# EAGLE design Adafruit AD849x_Thermo (EAGLE 8.7.1)
COMPANY: ADAFRUIT INDUSTRIES; DRAWN: KTOWN; REV: A
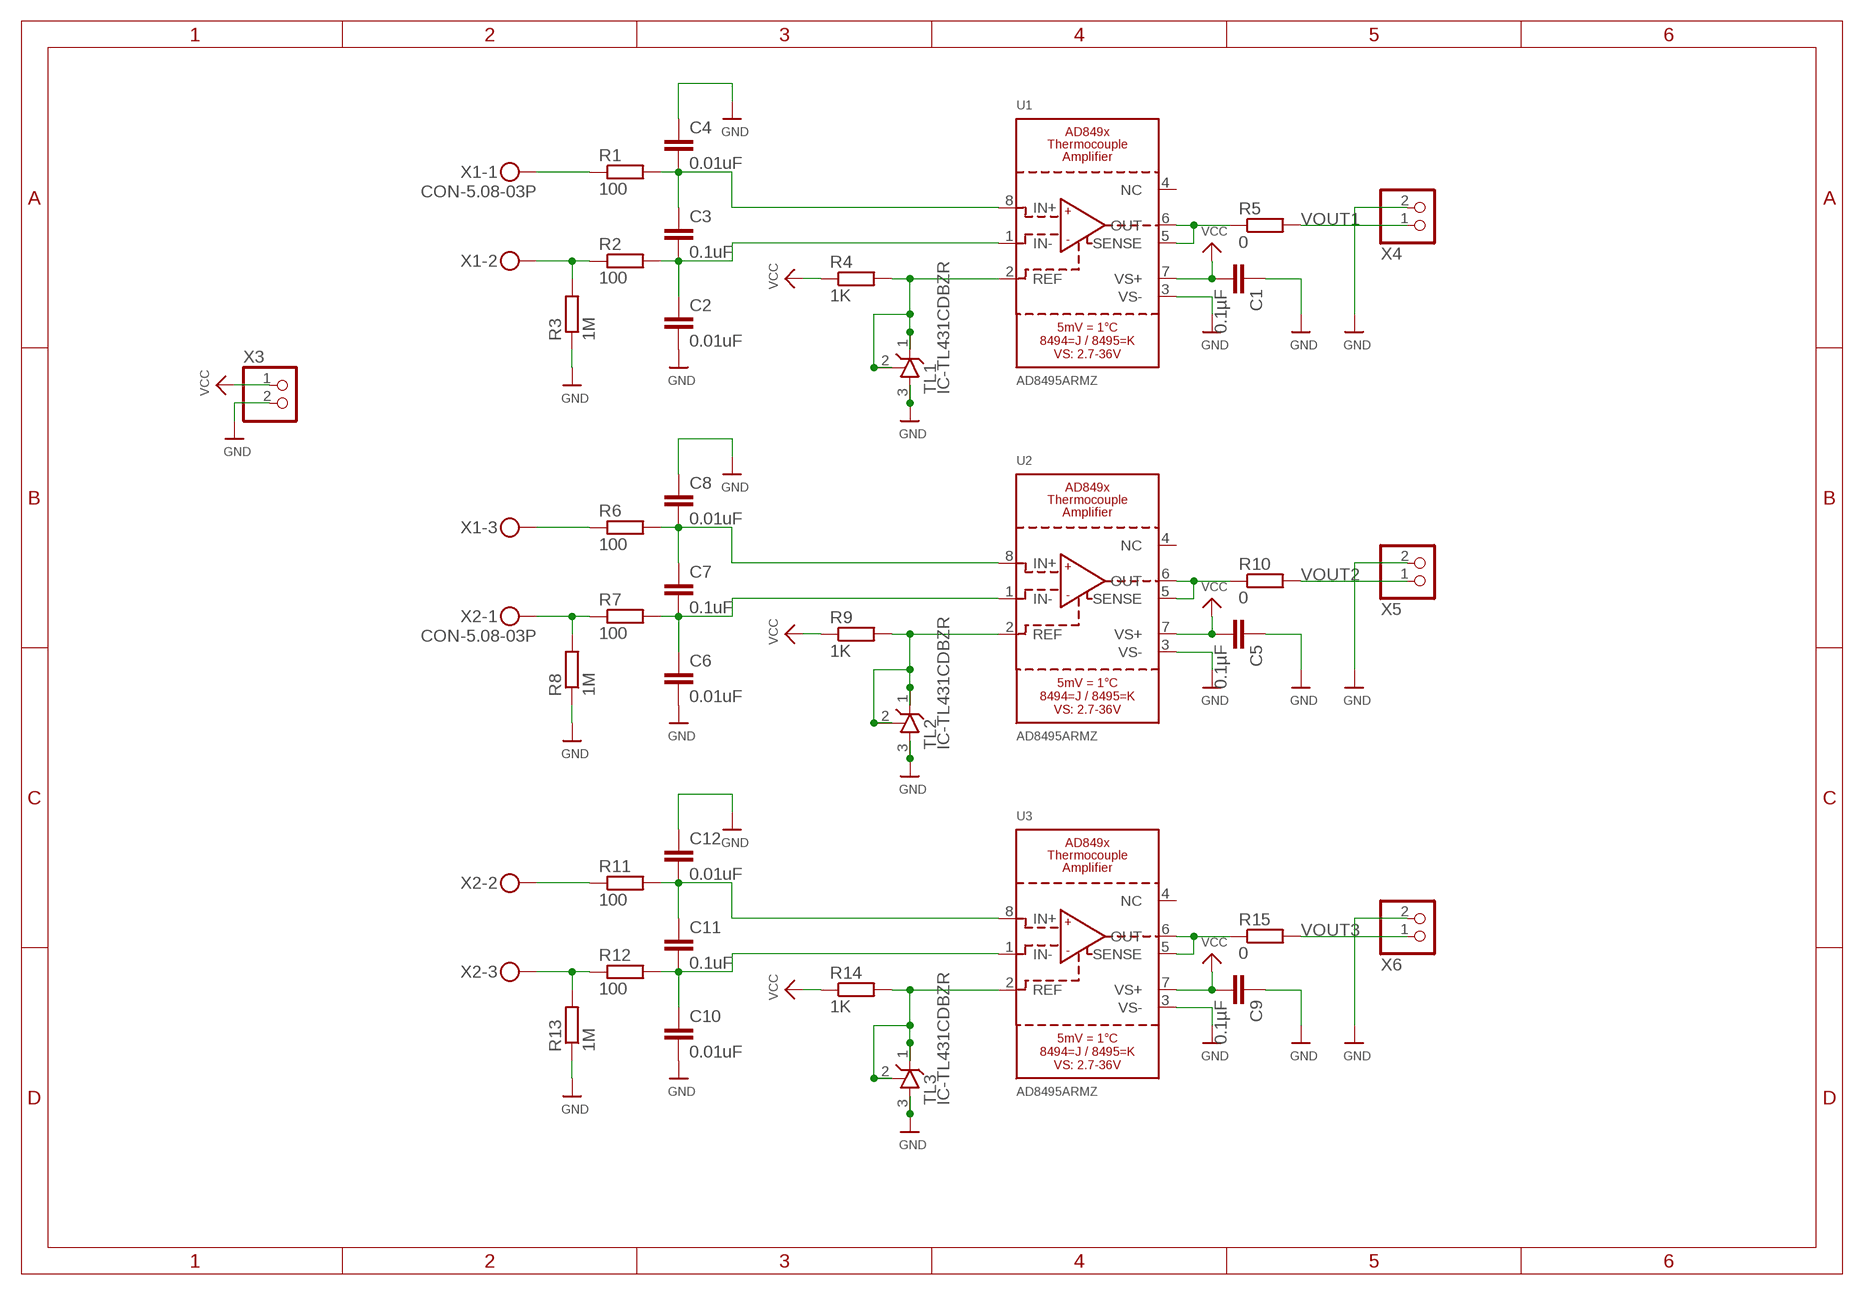
[diagram p0: schematic, sheet 1]

## Parts
C1  0.1µF  CAP_0805  [C0805]
C2  0.01uF  CAP_0805  [C0805]
C3  0.1uF  CAP_0805  [C0805]
C4  0.01uF  CAP_0805  [C0805]
C5  0.1µF  CAP_0805  [C0805]
C6  0.01uF  CAP_0805  [C0805]
C7  0.1uF  CAP_0805  [C0805]
C8  0.01uF  CAP_0805  [C0805]
C9  0.1µF  CAP_0805  [C0805]
C10  0.01uF  CAP_0805  [C0805]
C11  0.1uF  CAP_0805  [C0805]
C12  0.01uF  CAP_0805  [C0805]
R1  100  R_0805  [R0805]
R2  100  R_0805  [R0805]
R3  1M  R_0805  [R0805]
R4  1K  R_0805  [R0805]
R5  0  R_0805  [R0805]
R6  100  R_0805  [R0805]
R7  100  R_0805  [R0805]
R8  1M  R_0805  [R0805]
R9  1K  R_0805  [R0805]
R10  0  R_0805  [R0805]
R11  100  R_0805  [R0805]
R12  100  R_0805  [R0805]
R13  1M  R_0805  [R0805]
R14  1K  R_0805  [R0805]
R15  0  R_0805  [R0805]
TL1  IC-TL431CDBZR  [SOT23]
TL2  IC-TL431CDBZR  [SOT23]
TL3  IC-TL431CDBZR  [SOT23]
U1  AD8495ARMZ  AD849X  [MSOP8_0.65MM]
U2  AD8495ARMZ  AD849X  [MSOP8_0.65MM]
U3  AD8495ARMZ  AD849X  [MSOP8_0.65MM]
X1  CON-5.08-03P  [MKDSN1,5/3-5,08]
X2  CON-5.08-03P  [MKDSN1,5/3-5,08]
X3  CON-CP-02  [CON-CT-02]
X4  CON-CP-02  [CON-CT-02]
X5  CON-CP-02  [CON-CT-02]
X6  CON-CP-02  [CON-CT-02]

## Nets
GND: C1.1 C2.2 C4.1 C5.1 C6.2 C8.1 C9.1 C10.2 C12.1 R3.1 R8.1 R13.1 TL1.3(A) TL2.3(A) TL3.3(A) U1.3(VS-) U2.3(VS-) U3.3(VS-) X3.2 X4.2 X5.2 X6.2
IN+: R1.1 X1.1
IN+1: R6.1 X1.3
IN+2: R11.1 X2.2
IN-: R2.1 R3.2 X1.2
IN-1: R7.1 R8.2 X2.1
IN-2: R12.1 R13.2 X2.3
N$1: R4.2 TL1.1(C) TL1.2(R) U1.2(REF)
N$2: C3.1 C4.2 R1.2 U1.8(IN+)
N$3: C2.1 C3.2 R2.2 U1.1(IN-)
N$4: R5.2 X4.1
N$6: C7.1 C8.2 R6.2 U2.8(IN+)
N$7: C6.1 C7.2 R7.2 U2.1(IN-)
N$8: R9.2 TL2.1(C) TL2.2(R) U2.2(REF)
N$9: R10.2 X5.1
N$10: C11.1 C12.2 R11.2 U3.8(IN+)
N$11: C10.1 C11.2 R12.2 U3.1(IN-)
N$12: R14.2 TL3.1(C) TL3.2(R) U3.2(REF)
N$13: R15.2 X6.1
VCC: C1.2 C5.2 C9.2 R4.1 R9.1 R14.1 U1.7(VS+) U2.7(VS+) U3.7(VS+) X3.1
VOUT1: R5.1 U1.5(SENSE) U1.6(OUT)
VOUT2: R10.1 U2.5(SENSE) U2.6(OUT)
VOUT3: R15.1 U3.5(SENSE) U3.6(OUT)
Unconnected: U1.4(NC) U2.4(NC) U3.4(NC)

## Library data of the parts
C1-C12 = Namenlos:CAP_
R1-R15 = Namenlos:R_
TL1-TL3 = Namenlos:IC-TL431
U1-U3 = microbuilder:AD849X: AD8494/8495 - Precision Thermocouple Amplifier with Cold Junction Compensation For J-Type Thermocouples use AD8494, For K-Type use AD8495 5 mV/°C thermometer output Single Supply: 2.7 V to 36 V Dual Supply: ±2.7 V to ±18 V
X1 X2 = Namenlos:CON-5.08-03P: MKDSN 1,5/ 3-5,08 Printklemme Nennstrom: 13,5 A Nennspannung: 250 V Rastermaß: 5,08 mm Polzahl: 3 Anschlussart: Schraubanschluss Montage: Löten Anschlussrichtung Leiter/Platine: 0 ° Artikelnummer: 1729131 Source: http://eshop.phoenixcontact.com .. 1729131.pdf
X3-X6 = Namenlos:CON-CP-02

## Board
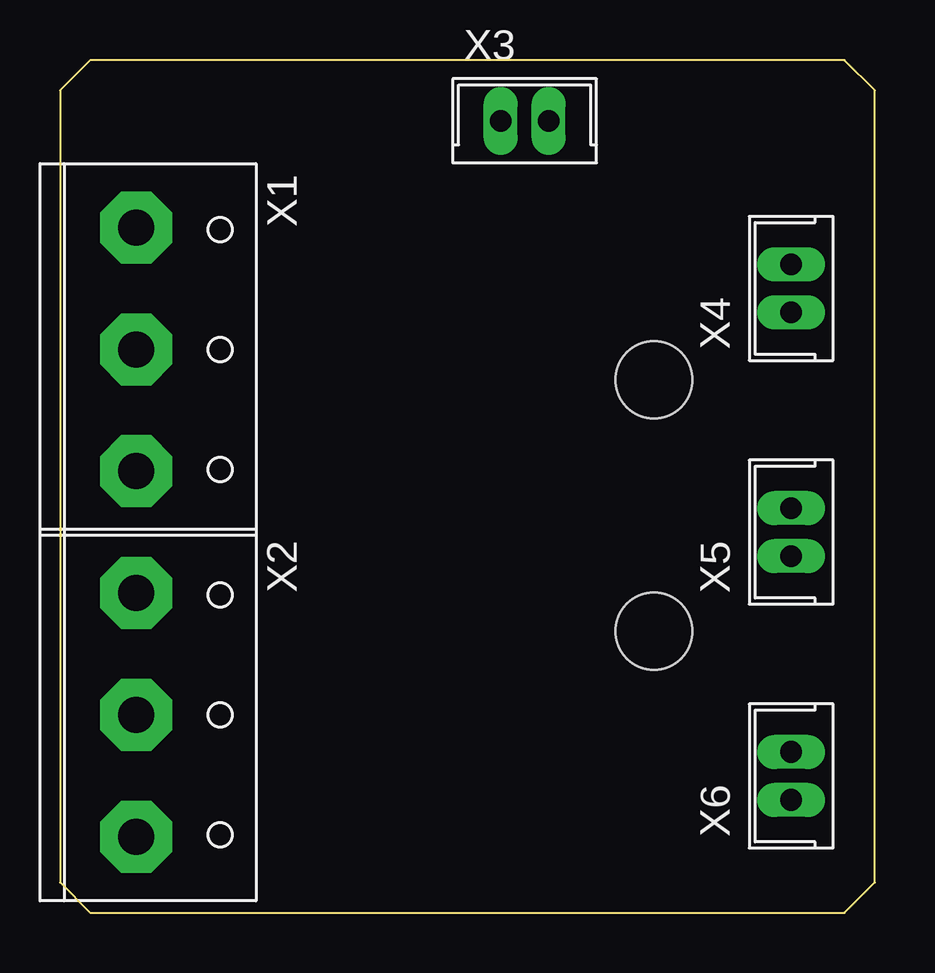
[diagram p1: board, top side]
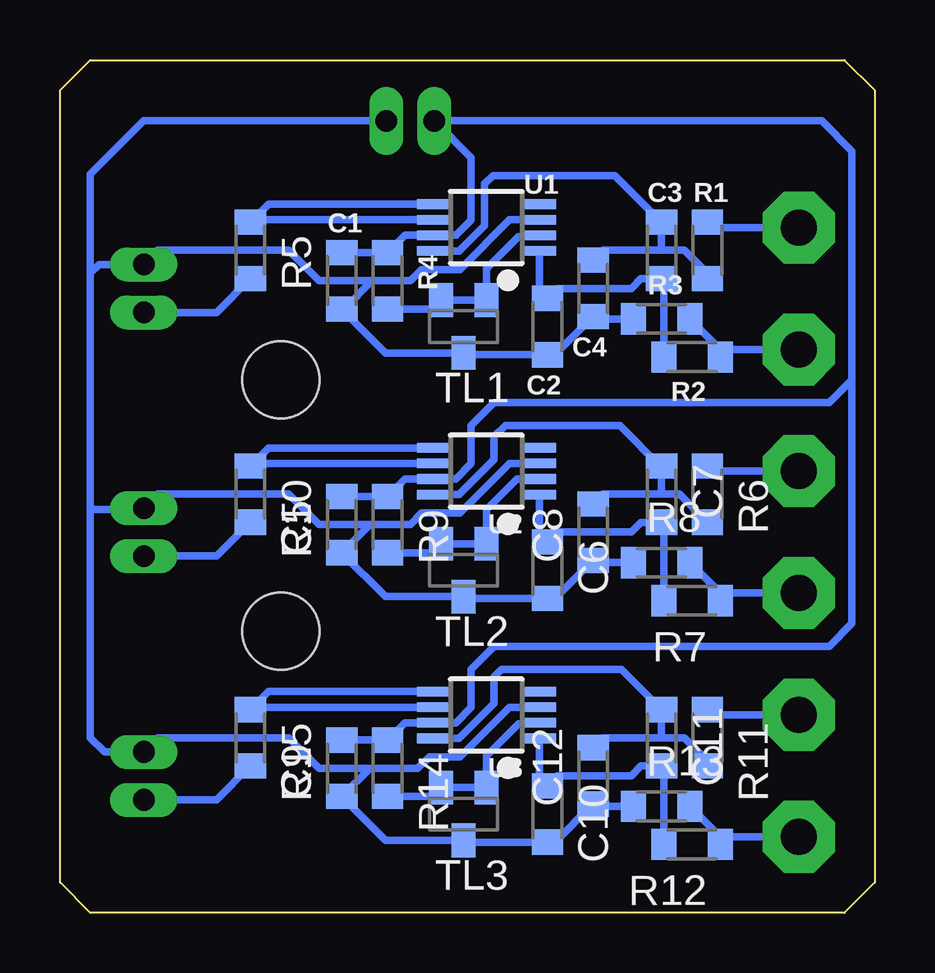
[diagram p2: board, bottom side, seen from below]

Size 33.97 x 35.56 mm. Coordinates in mm from the lower left corner, seen from the top.
Outline: 0,1.27 1.27,0 32.7,0 33.97,1.27 33.97,34.29 32.7,35.56 1.27,35.56 0,34.29 0,1.27
Copper layers (1*16): Top 0.035mm / dielectric 1.5mm / Bottom 0.035mm
Design rules "EagleDesignRules": minimum track width 0.25mm, minimum drill 0.3mm, track to track 0.25mm, track to pad 0.25mm, pad to pad 0.25mm, via to via 0.25mm, smd to smd 0.25mm, copper to edge 0.5mm, drill to drill 0.5mm, minimum pad ring 10mil, minimum via ring 8mil, stop-mask expansion 4mil, vias tented up to drill 0mil, thermal gap 0.25mm
Holes 3.2 mm at 24.77,22.23 24.77,11.75

### Footprints (pad centres in the part's own frame; a part is rotated, then mirrored left to right if it is on the bottom)
C0805 = smd 1.05 x 1.3: 1 -1.175,0; 2 1.175,0
R0805 = smd 1.05 x 1.3: 1 -1.175,0; 2 1.175,0
SOT23 = smd 1 x 1.4: 1 -0.95,-1.1; 2 0.95,-1.1; 3 0,1.1
MSOP8_0.65MM = smd 0.4 x 1.4: 1 -0.975,-2.2; 2 -0.325,-2.2; 3 0.325,-2.2; 4 0.975,-2.2; 5 0.975,2.2; 6 0.325,2.2; 7 -0.325,2.2; 8 -0.975,2.2
MKDSN1,5/3-5,08 = drill 1.5 pad 3 octagon: 1 -5.08,0; 2 0,0; 3 5.08,0
CON-CT-02 = drill 0.9 long: 1 -1,0; 2 1,0

### Placement (x,y rotation side)
C1  22.23,26.35 90 bottom
C2  13.65,24.45 270 bottom
C3  8.89,27.62 270 bottom
C4  11.75,26.04 90 bottom
C5  22.23,16.19 90 bottom
C6  13.65,14.29 270 bottom
C7  8.89,17.46 270 bottom
C8  11.75,15.88 90 bottom
C9  22.23,6.03 90 bottom
C10  13.65,4.13 270 bottom
C11  8.89,7.3 270 bottom
C12  11.75,5.71 90 bottom
R1  6.98,27.62 270 bottom
R2  7.62,23.18 180 bottom
R3  8.89,24.77 0 bottom
R4  20.32,26.35 270 bottom
R5  26.04,27.62 270 bottom
R6  6.98,17.46 270 bottom
R7  7.62,13.02 180 bottom
R8  8.89,14.61 0 bottom
R9  20.32,16.19 270 bottom
R10  26.04,17.46 270 bottom
R11  6.98,7.3 270 bottom
R12  7.62,2.86 180 bottom
R13  8.89,4.45 0 bottom
R14  20.32,6.03 270 bottom
R15  26.04,7.3 270 bottom
TL1  17.14,24.45 180 bottom
TL2  17.14,14.29 180 bottom
TL3  17.14,4.13 180 bottom
U1  16.19,28.57 90 bottom
U2  16.19,18.41 90 bottom
U3  16.19,8.25 90 bottom
X1  3.17,23.5 270 top
X2  3.17,8.25 270 top
X3  19.37,33.02 0 top
X4  30.48,26.04 90 top
X5  30.48,15.88 90 top
X6  30.48,5.71 90 top

### Tracks (layer width: path | path; a pad name or v marks a point on that pad's centre or on a via)
GND
  Bottom 0.305: R3.1 11.65,24.77 C4.1 13.34,23.27 C2.2 17.07,23.27 TL1.3 20.39,23.35 C1.1 22.13,25.18 20.95,26.35 | 20.95,26.35 19.37,26.35 18.89,26.83 17.3,26.83 15.23,28.9 U1.3 | U2.3 15.23,18.74 17.3,16.67 18.89,16.67 19.37,16.19 21.05,16.19 | 21.05,16.19 C5.1 20.39,13.19 TL2.3 17.07,13.11 C6.2 13.34,13.11 C8.1 11.65,14.61 R8.1 | R13.1 11.65,4.45 C12.1 13.34,2.95 C10.2 17.07,2.95 TL3.3 20.39,3.03 C9.1 21.05,6.03 | 21.05,6.03 19.06,6.03 18.76,6.33 18.75,6.33 18.57,6.51 17.3,6.51 15.23,8.58 U3.3 | 21.05,6.03 23.18,6.03 24.45,7.3 29.89,7.3 X6.2 32.12,6.71 32.7,7.3 32.7,16.83 | 21.05,16.19 23.18,16.19 24.45,17.46 29.89,17.46 X5.2 30.53,16.83 32.7,16.83 | 20.95,26.35 23.18,26.35 24.45,27.62 29.89,27.62 X4.2 32.34,27.04 32.7,26.67 | 32.7,26.67 32.7,16.83 | 32.7,26.67 32.7,30.8 30.48,33.02 X3.2
IN+
  Bottom 0.305: X1.1 6.76,28.57 R1.1
IN+1
  Bottom 0.305: X1.3 6.76,18.41 R6.1
IN+2
  Bottom 0.305: X2.2 6.76,8.25 R11.1
IN-
  Bottom 0.305: X1.2 6.13,23.5 R2.1 6.45,23.5 R3.2
IN-1
  Bottom 0.305: X2.1 6.13,13.34 R7.1 6.45,13.34 R8.2
IN-2
  Bottom 0.305: X2.3 6.13,3.18 R12.1 6.45,3.18 R13.2
N$1
  Bottom 0.305: R4.2 18.46,25.18 TL1.2 TL1.1 16.2,26.87 14.86,28.2 14.04,28.2 U1.2
N$2
  Bottom 0.305: R1.2 6.98,26.67 7.94,27.62 8.89,27.62 | 8.89,27.62 C3.1 10.83,30.74 15.93,30.74 16.27,30.4 16.27,28.66 17.34,27.6 U1.8 | 8.89,27.62 11.34,27.62 C4.2
N$3
  Bottom 0.305: R2.2 8.79,26.35 C3.2 9.75,26.45 10.16,26.04 13.24,26.04 C2.1 13.99,25.96 U1.1
N$4
  Bottom 0.305: X4.1 27.45,25.04 R5.2
N$6
  Bottom 0.305: R6.2 8.16,17.46 8.89,17.46 | C8.2 11.34,17.46 8.89,17.46 | C7.1 8.89,18.57 | 8.89,18.57 8.89,17.46 | 8.89,18.57 10.64,20.32 15.41,20.32 15.88,19.85 15.88,18.9 17.34,17.44 U2.8
N$7
  Bottom 0.305: R7.2 8.79,16.19 C7.2 9.75,16.29 10.16,15.88 13.24,15.88 C6.1 13.99,15.8 U2.1
N$8
  Bottom 0.305: R9.2 18.46,15.02 TL2.2 TL2.1 16.19,16.83 14.93,18.09 U2.2
N$9
  Bottom 0.305: R10.2 27.45,14.88 X5.1
N$10
  Bottom 0.305: R11.2 6.98,6.35 7.94,7.3 8.89,7.3 | 8.89,7.3 C11.1 10.57,10.16 15.56,10.16 15.88,9.84 15.88,8.74 17.34,7.28 U3.8 | C12.2 11.34,7.3 8.89,7.3
N$11
  Bottom 0.305: R12.2 8.79,6.03 C11.2 9.75,6.13 10.16,5.71 13.24,5.71 C10.1 13.99,5.64 U3.1
N$12
  Bottom 0.305: U3.2 14.04,7.88 14.86,7.88 16.2,6.55 TL3.1 TL3.2 18.46,4.86 R14.2
N$13
  Bottom 0.305: R15.2 27.45,4.71 X6.1
VCC
  Bottom 0.305: C1.2 R4.1 19.6,28.25 U1.7 17.47,28.25 16.83,28.89 16.83,31.48 X3.1 2.22,33.02 0.95,31.75 0.95,22.23 | C5.2 R9.1 19.6,18.09 U2.7 17.47,18.09 16.83,18.73 16.83,20.32 15.88,21.27 1.9,21.27 0.95,22.23 | C9.2 R14.1 19.6,7.93 U3.7 17.47,7.93 16.83,8.57 16.83,10.16 15.88,11.11 1.9,11.11 0.95,12.06 0.95,22.23
VOUT1
  Bottom 0.305: U1.5 25.28,29.55 R5.1 25.93,28.9 U1.6
VOUT2
  Bottom 0.305: U2.5 25.28,19.39 R10.1 25.93,18.74 U2.6
VOUT3
  Bottom 0.305: U3.5 25.28,9.23 25.83,8.68 | 25.83,8.68 R15.1 | U3.6 25.73,8.58 25.83,8.68